# Altium project MiniPC.PrjPcb (part 9 of 17)

## Sheet USB3.0.SchDoc: USB3.0
size B; DocumentNumber: 16; SheetNumber: 16; SheetTotal: 46
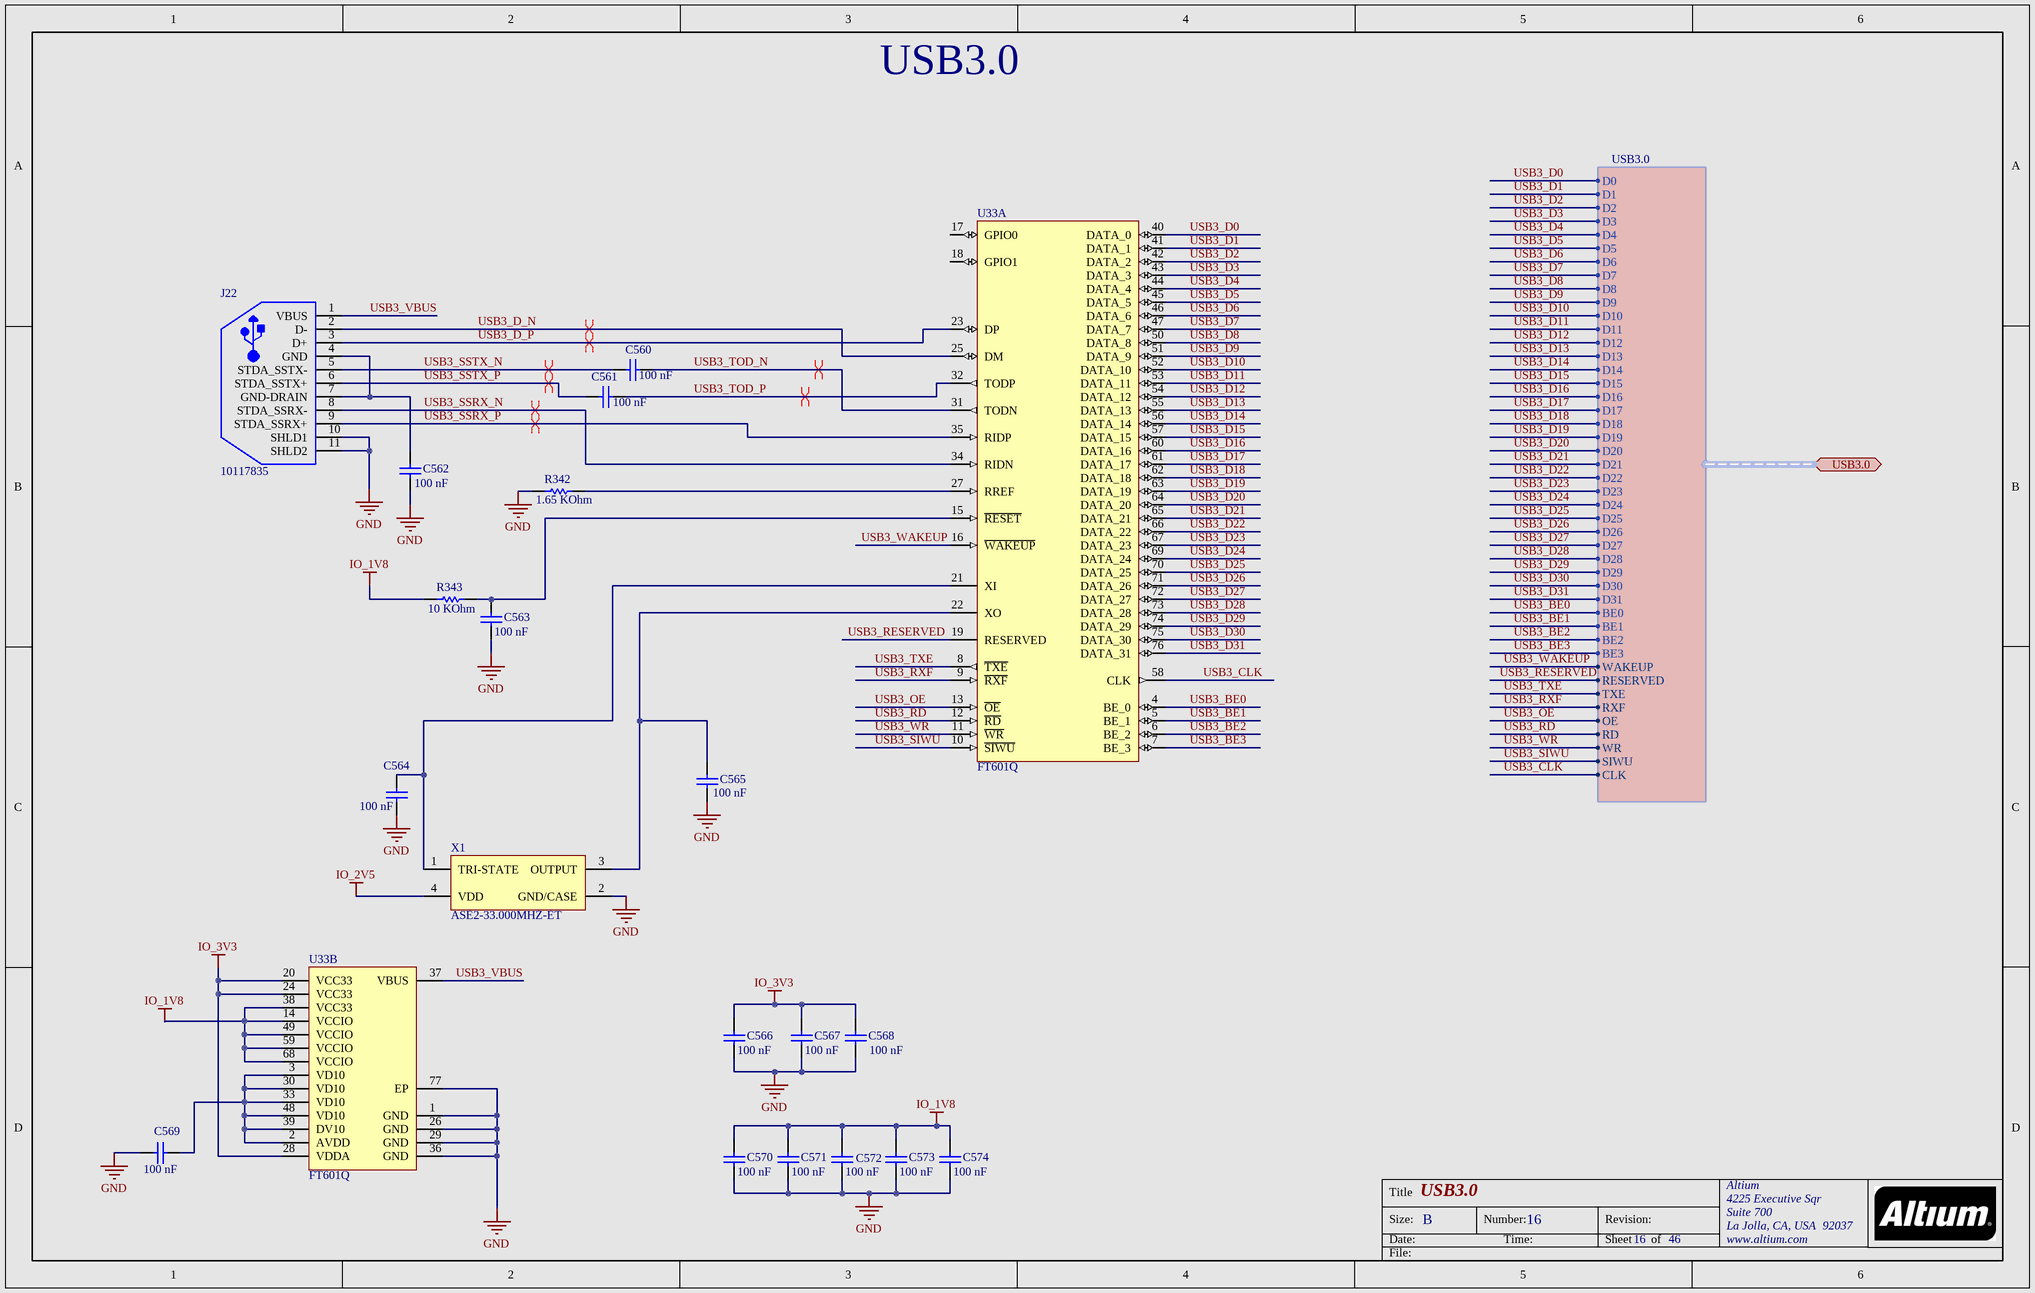
[diagram p32: USB3.0.SchDoc]

### Parts
C560  Capacitance: 100 nF  [CAPC0603X33X15LL03T05]  (hidden comment: GRM033R60J104KE19D)
C561  Capacitance: 100 nF  [CAPC0603X33X15LL03T05]  (hidden comment: GRM033R60J104KE19D)
C562  Capacitance: 100 nF  [CAPC0603X33X15LL03T05]  (hidden comment: GRM033R60J104KE19D)
C563  Capacitance: 100 nF  [CAPC0603X33X15LL03T05]  (hidden comment: GRM033R60J104KE19D)
C564  Capacitance: 100 nF  [CAPC0603X33X15LL03T05]  (hidden comment: GRM033R60J104KE19D)
C565  Capacitance: 100 nF  [CAPC0603X33X15LL03T05]  (hidden comment: GRM033R60J104KE19D)
C566  Capacitance: 100 nF  [CAPC1005X55X10LL05]  (hidden comment: C1005X7R1E104M)
C567  Capacitance: 100 nF  [CAPC1005X55X10LL05]  (hidden comment: C1005X7R1E104M)
C568  Capacitance: 100 nF  [CAPC1005X55X10LL05]  (hidden comment: C1005X7R1E104M)
C569  Capacitance: 100 nF  [CAPC0603X33X15LL03T05]  (hidden comment: GRM033R60J104KE19D)
C570  Capacitance: 100 nF  [CAPC1005X55X10LL05]  (hidden comment: C1005X7R1E104M)
C571  Capacitance: 100 nF  [CAPC1005X55X10LL05]  (hidden comment: C1005X7R1E104M)
C572  Capacitance: 100 nF  [CAPC1005X55X10LL05]  (hidden comment: C1005X7R1E104M)
C573  Capacitance: 100 nF  [CAPC1005X55X10LL05]  (hidden comment: C1005X7R1E104M)
C574  Capacitance: 100 nF  [CAPC1005X55X10LL05]  (hidden comment: C1005X7R1E104M)
J22  10117835  [FCI-10117835_V]
R342  Resistance: 1.65 KOhm  [RESC1005X40X25LL05T05]  (hidden comment: ERJ-2RKF1651X)
R343  Resistance: 10 KOhm  [RESC1005X40X25NL05T05]  (hidden comment: ERJ-2RKF1002X)
U33  FT601Q  [FTDI-QFN-76_M]  (parts A,B of 2)
X1  ASE2-33.000MHZ-ET  [ABRA-ASE2_V]

### Ports
USB3.0 (harness USB3.0)

### Harnesses
USB3.0: RD, OE, RXF, TXE, RESERVED, WAKEUP, WR, SIWU, CLK, D0, D1, D2, D3, D4, D5, D6, D7, D8, D9, D10, D11, D12, D13, D14, D15, D16, D17, D18, D19, D20, D21, D22, D23, D24, D25, D26, D27, D28, D29, D30, D31, BE0, BE1, BE2, BE3

### Nets
GND: C562.1 C563.1 C564.1 C565.1 C566.1 C567.1 C568.1 C569.2 C570.1 C571.1 C572.1 C573.1 C574.1 J22.10(SHLD1) J22.11(SHLD2) R342.2 U33.1(GND) U33.26(GND) U33.29(GND) U33.36(GND) U33.77(EP) X1.2(GND/CASE)
IO_1V8: C570.2 C571.2 C572.2 C573.2 C574.2 R343.1 U33.14(VCCIO) U33.38(VCC33) U33.49(VCCIO) U33.59(VCCIO) U33.68(VCCIO)
IO_2V5: X1.4(VDD)
IO_3V3: C566.2 C567.2 C568.2 U33.20(VCC33) U33.24(VCC33) U33.28(VDDA)
USB3_BE0: U33.4(BE_0) ; port USB3.0.BE0
USB3_BE1: U33.5(BE_1) ; port USB3.0.BE1
USB3_BE2: U33.6(BE_2) ; port USB3.0.BE2
USB3_BE3: U33.7(BE_3) ; port USB3.0.BE3
USB3_CLK: U33.58(CLK) ; port USB3.0.CLK
USB3_D0: U33.40(DATA_0) ; port USB3.0.D0
USB3_D1: U33.41(DATA_1) ; port USB3.0.D1
USB3_D2: U33.42(DATA_2) ; port USB3.0.D2
USB3_D3: U33.43(DATA_3) ; port USB3.0.D3
USB3_D4: U33.44(DATA_4) ; port USB3.0.D4
USB3_D5: U33.45(DATA_5) ; port USB3.0.D5
USB3_D6: U33.46(DATA_6) ; port USB3.0.D6
USB3_D7: U33.47(DATA_7) ; port USB3.0.D7
USB3_D8: U33.50(DATA_8) ; port USB3.0.D8
USB3_D9: U33.51(DATA_9) ; port USB3.0.D9
USB3_D10: U33.52(DATA_10) ; port USB3.0.D10
USB3_D11: U33.53(DATA_11) ; port USB3.0.D11
USB3_D12: U33.54(DATA_12) ; port USB3.0.D12
USB3_D13: U33.55(DATA_13) ; port USB3.0.D13
USB3_D14: U33.56(DATA_14) ; port USB3.0.D14
USB3_D15: U33.57(DATA_15) ; port USB3.0.D15
USB3_D16: U33.60(DATA_16) ; port USB3.0.D16
USB3_D17: U33.61(DATA_17) ; port USB3.0.D17
USB3_D18: U33.62(DATA_18) ; port USB3.0.D18
USB3_D19: U33.63(DATA_19) ; port USB3.0.D19
USB3_D20: U33.64(DATA_20) ; port USB3.0.D20
USB3_D21: U33.65(DATA_21) ; port USB3.0.D21
USB3_D22: U33.66(DATA_22) ; port USB3.0.D22
USB3_D23: U33.67(DATA_23) ; port USB3.0.D23
USB3_D24: U33.69(DATA_24) ; port USB3.0.D24
USB3_D25: U33.70(DATA_25) ; port USB3.0.D25
USB3_D26: U33.71(DATA_26) ; port USB3.0.D26
USB3_D27: U33.72(DATA_27) ; port USB3.0.D27
USB3_D28: U33.73(DATA_28) ; port USB3.0.D28
USB3_D29: U33.74(DATA_29) ; port USB3.0.D29
USB3_D30: U33.75(DATA_30) ; port USB3.0.D30
USB3_D31: U33.76(DATA_31) ; port USB3.0.D31
USB3_D_N: J22.2(D-) U33.25(DM)
USB3_D_P: J22.3(D+) U33.23(DP)
USB3_OE: U33.13(~{OE}) ; port USB3.0.OE
USB3_RD: U33.12(~{RD}) ; port USB3.0.RD
USB3_RESERVED: U33.19(RESERVED) ; port USB3.0.RESERVED
USB3_RXF: U33.9(~{RXF}) ; port USB3.0.RXF
USB3_SIWU: U33.10(~{SIWU}) ; port USB3.0.SIWU
USB3_SSRX_N: J22.8(STDA_SSRX-) U33.34(RIDN)
USB3_SSRX_P: J22.9(STDA_SSRX+) U33.35(RIDP)
USB3_SSTX_N: C560.2 J22.5(STDA_SSTX-)
USB3_SSTX_P: C561.2 J22.6(STDA_SSTX+)
USB3_TOD_N: C560.1 U33.31(TODN)
USB3_TOD_P: C561.1 U33.32(TODP)
USB3_TXE: U33.8(~{TXE}) ; port USB3.0.TXE
USB3_VBUS: J22.1(VBUS) U33.37(VBUS)
USB3_WAKEUP: U33.16(~{WAKEUP}) ; port USB3.0.WAKEUP
USB3_WR: U33.11(~{WR}) ; port USB3.0.WR
NetC562_2: C562.2 J22.4(GND) J22.7(GND-DRAIN)
NetC563_2: C563.2 R343.2 U33.15(~{RESET})
NetC564_2: C564.2 U33.21(XI) X1.1(TRI-STATE)
NetC565_2: C565.2 U33.22(XO) X1.3(OUTPUT)
NetC569_1: C569.1 U33.2(AVDD) U33.3(VD10) U33.30(VD10) U33.33(VD10) U33.39(DV10) U33.48(VD10)
NetR342_1: R342.1 U33.27(RREF)

Not connected (* = marked no-connect by the designer): U33 17(GPIO0) 18(GPIO1)

### Layout directives
differential pair: USB3_D_N, USB3_D_P, USB3_SSRX_N, USB3_SSRX_P, USB3_SSTX_N, USB3_SSTX_P, USB3_TOD_N, USB3_TOD_P

### Notes on the sheet
- Title
- Size:
- Date:
- B
- Number:
- Time:
- Revision:
- Sheet
- of
- File:

### Library data of the parts
C560-C565 C569 = CMP-2010-01652-4: Chip Capacitor, 100 nF, +/- 10%, 6.3 V, -55 to 85 degC, 0201 (0603 Metric), RoHS, Tape and Reel; Manufacturer: Basic Passives; Voltage Rating: 6.3 V; Type (Capacitors): X5R; Voltage Rating (DC): 3 V; Case\/Package: 0201; Min Operating Temperature: -55 degC; PartNumber: GRM033R60J104KE19D; Mounting Technology: Surface Mount; RoHSCompliant: true; Max Operating Temperature: 85 degC; Package Quantity: 15000; Packaging: Tape and Reel; Tolerance: 10%; Case Code (Imperial): 0201; Width: 0.3 mm; ComponentLink1URL: http://www.murata.com/; Case Code (Metric): 0603; ComponentLink1Description: Manufacturer URL; REACH SVHC: No SVHC; Height: 0.3 mm; Length: 0.6 mm; PackageDescription: 2-Pin Surface Mount Device, Body 0.6 x 0.3 mm; ComponentLink2Description: Datasheet; Pins: 2; PackageReference: 0201; Mount: Surface Mount; ComponentLink2URL: http://search.murata.co.jp/Ceramy/image/img/A01X/G101/ENG/GRM033R60J104KE19-01.pdf; DatasheetVersion: 03/2016; Radiation Hardening: No
C566-C568 C570-C574 = CMP-1663-00009-2: as C369 on sheet Ethernet-HPS; Tolerance: 20%; Max Operating Temperature: 125 degC; ComponentLink2URL: http://www.farnell.com/datasheets/1571323.pdf; ComponentLink1URL: http://www.tdk.com/; RoHSCompliant: true; Packaging: Tape and Reel; Mounting Technology: Surface Mount; ComponentLink2Description: Datasheet; Case Code (Imperial): 0402; DatasheetVersion: 09/2011; ComponentLink1Description: Manufacturer URL; PackageDescription: 2-Pin Surface Mount Device, Body 1 x 0.5 mm; PackageReference: 0402; Min Operating Temperature: -55 degC; Case Code (Metric): 1005; Height: 0.5 mm; Package Quantity: 10000; Width: 0.5 mm; Pins: 2; Voltage Rating (DC): 25 V; PartNumber: C1005X7R1E104M; Mount: Surface Mount; Length: 1 mm
J22 = CMP-1698-00002-1: USB 3.0 Standard-A Receptacle Right Angle Type Soldering to Board Termination, 30 V, -55 to 85 degC, 9-Pin THD, RoHS, Tray; PackageReference: 10117835; ComponentLink1URL: http://portal.fciconnect.com/; PackageDescription: 9-Pin Through Hole Device, Body 15.6 x 16.5 mm; ComponentLink1Description: Manufacturer URL; Mounting Technology: Through Hole; DatasheetVersion: Rev. B, 05/2014; ComponentLink3Description: Package Specification; ComponentLink3URL: http://portal.fciconnect.com/Comergent/fci/drawing/10117835.pdf; ComponentLink2URL: http://portal.fciconnect.com/Comergent/fci/documentation/gs-12-0928.pdf; ComponentLink2Description: Datasheet
R342 = CMP-2002-00716-3: Chip Resistor, 1.65 KOhm, +/- 1%, 100 mW, -55 to 155 degC, 0402 (1005 Metric), RoHS, Tape and Reel; Manufacturer: Basic Passives; Voltage Rating: 50 V; Power Rating: 100 mW; Case\/Package: 0402; Tolerance: 1%; ComponentLink1URL: http://www.panasonic.com/; RoHSCompliant: true; Package Quantity: 10000; REACH SVHC: Yes; Packaging: Tape and Reel; Mount: Surface Mount; PartNumber: ERJ-2RKF1651X; Case Code (Imperial): 0402; Height: 0.35 mm; Min Operating Temperature: -55 degC; ComponentLink1Description: Manufacturer URL; Mounting Technology: Surface Mount; Width: 0.5 mm; PackageDescription: 2-Pin Surface Mount Device, Body 1 x 0.5 mm; Max Operating Temperature: 155 degC; Case Code (Metric): 1005; Length: 1 mm; PackageReference: 0402; DatasheetVersion: 04/2015; ComponentLink2URL: http://industrial.panasonic.com/cdbs/www-data/pdf/RDA0000/AOA0000C86.pdf; ComponentLink2Description: Datasheet; Pins: 2
R343 = CMP-2002-00607-3: as R311 on sheet Ethernet-HPS; Case Code (Imperial): 0402; Min Operating Temperature: -55 degC; PartNumber: ERJ-2RKF1002X; Mounting Technology: Surface Mount; Length: 1 mm; Packaging: Tape and Reel; ComponentLink1Description: Manufacturer URL; Mount: Surface Mount; Package Quantity: 10000; Max Operating Temperature: 155 degC; Case Code (Metric): 1005; Height: 0.35 mm; ComponentLink1URL: http://www.panasonic.com/; Tolerance: 1%; REACH SVHC: Yes; RoHSCompliant: true; Width: 0.5 mm; PackageDescription: 2-Pin Surface Mount Device, Body 1 x 0.5 mm; Radiation Hardening: No; PackageReference: 0402; ComponentLink2Description: Datasheet; DatasheetVersion: 04/2015; ComponentLink2URL: http://industrial.panasonic.com/cdbs/www-data/pdf/RDA0000/AOA0000C86.pdf; Pins: 2
U33 = CMP-1723-00001-1: 32 Bit USB 3.0 to FIFO Bridge, 5 Gbps, 3 to 3.6 V, -40 to 85 degC, 76-Pin QFN, Pb-Free; PackageDescription: 76-Pin Quad Flat No-lead Package, Body 9 x 9 mm, Pitch 0.4 mm, Thermal Pad 5.45 x 5.45 mm; ComponentLink2URL: http://www.ftdichip.com/Support/Documents/DataSheets/ICs/DS_FT600Q-FT601Q%20IC%20Datasheet.pdf; Mounting Technology: Surface Mount; ComponentLink1Description: Manufacturer URL; RoHSCompliant: false; PackageReference: QFN-76; DatasheetVersion: Rev. 1.02, 02/2016; ComponentLink1URL: http://www.ftdichip.com/; ComponentLink2Description: Datasheet; PartId: 1
X1 = CMP-1688-00001-1: CMOS Compatible SMD Crystal Oscillator, 33 MHz, 2.5 V, -20 to 70 degC, 4-Pin SMD, RoHS, Tape and Reel; Manufacturer: Abracon; Mounting Technology: Surface Mount; ComponentLink1Description: Manufacturer URL; PackageReference: ASE2; PartNumber: ASE2-33.000MHZ-ET; PackageDescription: 4-Pin Surface Mount Device, Body 3.2 x 2.5 mm, Pitch 2.1 mm; DatasheetVersion: Rev. Aug-14; ComponentLink2URL: http://www.abracon.com/Oscillators/ASE2series.pdf; ComponentLink2Description: Datasheet; ComponentLink1URL: http://www.abracon.com/